# Altium schematic sheet PowerUpDelay-SCR.SchDoc
size 419 x 297 mm; SPICEModelCacheTYFAZRPR: <root> / <DocumentId>TYFAZRPR</DocumentId> / </root>; Date: 2025/07/16; Author: Leon Lee; CompanyName: 华南理工大学; Organization: 华南理工大学; Address1: 五山路381号; Address2: 天河区，广州市; Address3: 广东省; DocumentNumber: A001-001-001; Revision: 0.2; SheetNumber: 1; SheetTotal: 1
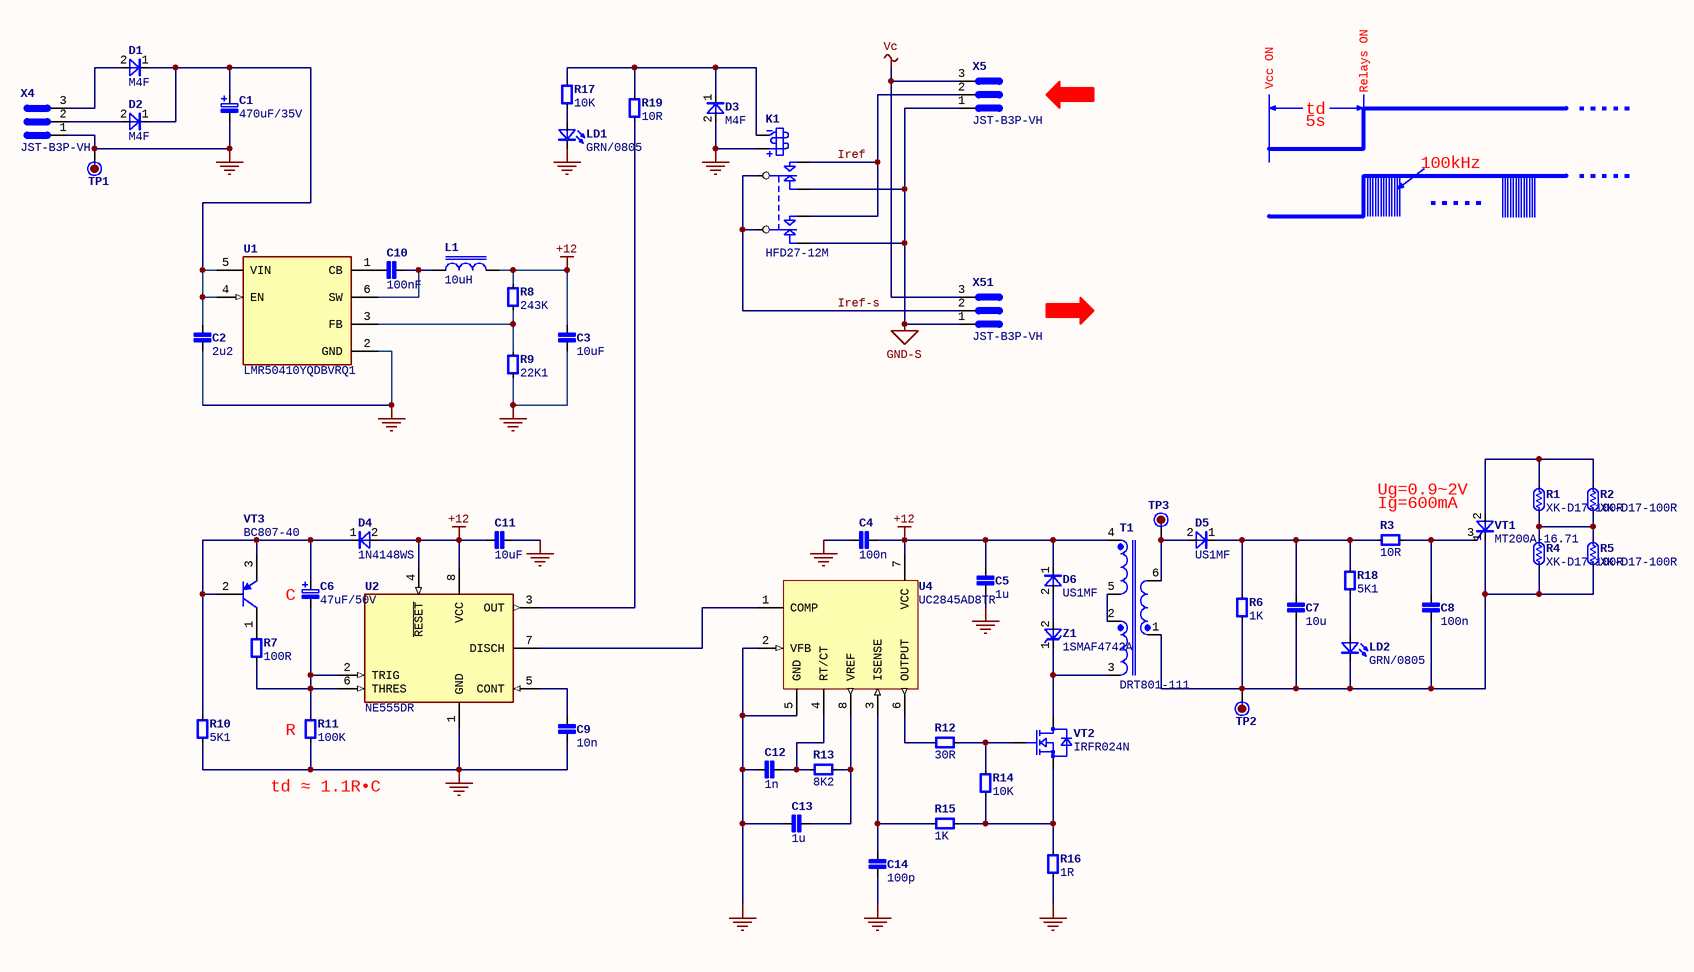
[diagram p0: PowerUpDelay-SCR.SchDoc]

## Parts
C1  470uF/35V  [RB5M/D10]
C2  2u2  [CAPC1206N]
C3  10uF  [CAPC0805N]
C4  100n  [CAPC0805N]
C5  1u  [CAPC0805N]
C6  47uF/50V  [RB2.5M/D6.3]
C7  10u  [CAPC1206N]
C8  100n  [CAPC1206N]
C9  10n  [CAPC0805N]
C10  100nF  [CAPC0805N]
C11  10uF  [CAPC0805N]
C12  1n  [CAPC0805N]
C13  1u  [CAPC0805N]
C14  100p  [CAPC0805N]
D1  M4F  [SMAF]
D2  M4F  [SMAF]
D3  M4F  [SMAF]
D4  1N4148WS  [SOD-323F-1K2A]
D5  US1MF  [SMAF]
D6  US1MF  [SMAF]
K1  HFD27-12M  [RLY-DPDT]
L1  10uH  [INDP4040X20N]
LD1  GRN/0805  [LEDC0805N]
LD2  GRN/0805  [LEDC0805N]
R1  XK-D17-100R  [PTC-X17]
R2  XK-D17-100R  [PTC-X17]
R3  10R  [RESC1206N]
R4  XK-D17-100R  [PTC-X17]
R5  XK-D17-100R  [PTC-X17]
R6  1K  [RESC1206N]
R7  100R  [RESC0805N]
R8  243K  [RESC0805N]
R9  22K1  [RESC0805N]
R10  5K1  [RESC0805N]
R11  100K  [RESC0805N]
R12  30R  [RESC0805N]
R13  8K2  [RESC0805N]
R14  10K  [RESC0805N]
R15  1K  [RESC0805N]
R16  1R  [RESC1206N]
R17  10K  [RESC0805N]
R18  5K1  [RESC0805N]
R19  10R  [RESC0805N]
T1  DRT801-111  [TRANS-DRT801-1+1+1]
TP1  TESTPOINT  [TESTPOINT]  (value not drawn)  (no BOM)
TP2  TESTPOINT  [TESTPOINT]  (value not drawn)  (no BOM)
TP3  TESTPOINT  [TESTPOINT]  (value not drawn)  (no BOM)
U1  LMR50410YQDBVRQ1  [FP-DBV0006A-MFG]
U2  NE555DR  [FP-D0008A-MFG]
U4  UC2845AD8TR  [D0008A_N]
VT1  MT200A-16.71  [MT200A-16.71]
VT2  IRFR024N  [ONSC-DPAK-3-369AA-01_V]
VT3  BC807-40  [SOT-23_N]
X4  JST-B3P-VH  [B3P-VH]
X5  JST-B3P-VH  [B3P-VH]
X51  JST-B3P-VH  [B3P-VH]
Z1  1SMAF4742A  [SMAF]

## Nets
+12: C3.1 C4.2 C5.1 C11.1 D4.2(A) D6.1(K) L1.2 R8.2 T1.4 U2.4(~{RESET}) U2.8(VCC) U4.7(VCC)
GND: C1.2 C2.2 C3.2 C4.1 C5.2 C9.2 C11.2 C12.1 C13.2 C14.2 D3.2(A) K1.COL1(COIL1) LD1.2(K) R9.1 R10.1 R11.2 R16.2 TP1.1 U1.2(GND) U2.1(GND) U4.2(VFB) U4.5(GND) X4.1
GND-S: K1.NC1 K1.NC2 X5.1 X51.1
Vc: X5.3 X51.3
Iref: K1.NO1 K1.NO2 X5.2
Iref-s: K1.COM1(COMMON1) K1.COM2(COMMON2) X51.2
NetC1_1: C1.1 C2.1 D1.1(K) D2.1(K) U1.4(EN) U1.5(VIN)
NetC6_1: C6.1 D4.1(K) R10.2 VT3.2(B) VT3.3(E)
NetC6_2: C6.2 R7.2 R11.1 U2.2(TRIG) U2.6(THRES)
NetC7_1: C7.1 D5.1(K) R3.1 R6.1 R18.1
NetC7_2: C7.2 C8.2 LD2.2(K) R4.1 R5.1 R6.2 T1.1 TP2.1 VT1.1(K)
NetC8_1: C8.1 R3.2 VT1.3(G)
NetC9_1: C9.1 U2.5(CONT)
NetC10_1: C10.1 U1.1(CB)
NetC10_2: C10.2 L1.1 U1.6(SW)
NetC12_2: C12.2 R13.2 U4.4(RT/CT)
NetC13_1: C13.1 R13.1 U4.8(VREF)
NetC14_1: C14.1 R15.1 U4.3(ISENSE)
NetD1_2: D1.2(A) X4.3
NetD2_2: D2.2(A) X4.2
NetD3_1: D3.1(K) K1.COL2(COIL2) R17.1 R19.1
NetD5_2: D5.2(A) T1.6 TP3.1
NetD6_2: D6.2(A) Z1.2(A)
NetLD1_1: LD1.1(A) R17.2
NetLD2_1: LD2.1(A) R18.2
NetR1_1: R1.1 R2.1 R4.2 R5.2
NetR1_2: R1.2 R2.2 VT1.2(A)
NetR7_1: R7.1 VT3.1(C)
NetR8_1: R8.1 R9.2 U1.3(FB)
NetR12_1: R12.1 R14.1 VT2.1(G)
NetR12_2: R12.2 U4.6(OUTPUT)
NetR14_2: R14.2 R15.2 R16.1 VT2.3(S)
NetR19_2: R19.2 U2.3(OUT)
NetT1_2: T1.2 T1.5
NetT1_3: T1.3 VT2.4(D) Z1.1(K)
NetU2_7: U2.7(DISCH) U4.1(COMP)

## Notes on the sheet
- Vcc ON
- Relays ON
- td
- 5s
- 100kHz
- Ug=0.9~2V
- Ig=600mA
- (near C6) C
- (near R11) R
- (near R11) td ≈ 1.1R•C
- DWG NO:
- 版  本
- REV:
- 摘          要
- 日  期
- 审  核
- 版 本
- 项目:
- 设 计
- 审 核
- 图 幅
- A3
- 第
- 页
- 共
- 版本控制
- 项目版本:
- 文件版本:

## Library data of the parts
C1 = CAPACITOR POL(S): 名称: 电解电容; 代号: C; 备注: Ø10x13mm，脚距5mm
C2 = CAPACITOR(S): 名称: 贴片陶瓷电容; 代号: C; 型号: X7R-50V-1206-10%; 备注: X7R/X5R系列
C3 C11 = CAPACITOR(S): 名称: 贴片陶瓷电容; 代号: C; 型号: X7R-25V-0805-10%; 备注: X7R/X5R系列
C4 C5 C9 C12-C14 = CAPACITOR(S): 备注: X5R或X7R系列; 代号: C; 名称: 贴片陶瓷电容; 型号: X7R-50V-0805-10%
C6 = CAPACITOR POL(S): 名称: 电解电容; 代号: C; 备注: Ø6.3x12mm，脚距2.5mm
C7 C8 = CAPACITOR(S): 备注: X5R或X7R系列; 代号: C; 名称: 贴片陶瓷电容; 型号: X7R-50V-1206-10%
C10 = CAPACITOR(S): 名称: 贴片陶瓷电容; 代号: C; 型号: X7R-50V-0805-10%; 备注: X7R/X5R系列
D1-D3 D5 D6 = DIODE(S): 二极管; 代号: D; 名称: 贴片二极管; 备注: SMAF封装
  D1-D3: 型号: M4F
  D5 D6: 型号: US1MF
D4 = DIODE(S): 二极管; 代号: D; 名称: 贴片二极管; 备注: SOD-323封装; 型号: 1N4148WS
K1 = RELAY-DPDT: 继电器; 代号: K; 名称: 信号继电器; 备注: 宏发, 线圈电压12V; 型号: HFD27-12M
L1 = IND: 代号: L; 名称: 贴片功率电感; 型号: XRRH3D28-100M; 备注: SMD, 4x4x3mm
LD1 LD2 = LED(S): 备注: 高亮; 代号: DS; 名称: 贴片LED; 型号: 0805-绿色
R1 R2 R4 R5 = RESISTOR(S) NL: None Liner Resistor; 代号: RP; 名称: PTC电阻; 型号: XK-MZ12-D17-100R; 备注: Ø17-100Ω，电焊机专用
R3 R6 R16 = RESISTOR(S): 名称: 贴片电阻; 代号: R; 型号: CR1206-1%; 备注: 风华或国巨
R7 R10 = RESISTOR(S): 电阻; 代号: R; 名称: 贴片电阻; 型号: CR0805-1%; 备注: 风华或国巨
R8 R9 = RESISTOR(S): 电阻; 代号: R; 名称: 贴片电阻; 型号: CR0805-1%
R11-R15 R17-R19 = RESISTOR(S): 名称: 贴片电阻; 代号: R; 型号: CR0805-1%; 备注: 风华或国巨
T1 = TRANSFORM-DRT801-111_FB: IGBT驱动变压器, DRT801/111, 12.5x16.6mm; 代号: T; 名称: 驱动变压器; 备注: 耀华德昌; 型号: DRT801-111
TP1-TP3 = TESTPOINT: 测试点; 代号: TP; 名称: 测试点
U1 = CMP-04918-000478-1: NIXON PLUS-LMR50410YQDBVRQ1; 代号: U; 名称: 贴片集成电路; 备注: TI; 型号: LMR50410YQDBVRQ1
U2 = CMP-1685-00007-2: IC OSC SGL TIMER 100KHZ 8-SOIC; Low Level Output Current: 200mA; Quiescent Current: 15mA; Min Supply Voltage: 4.5V; Number of Timers/Counters: 1; Max Supply Voltage: 16V; Operating Supply Current: 10mA; High Level Output Current: -200mA; 代号: U; 名称: 贴片集成电路; Packaging: Tape and Reel; Frequency: 100kHz; Weight: 0.002561oz; REACH SVHC: No SVHC; Package Quantity: 2500; Width: 3.91mm; Max Operating Temperature: 70°C; Contact Plating: Gold; Lead Free: Lead Free; Number of Pins: 8; Min Operating Temperature: 0°C; Radiation Hardening: No; Length: 4.9mm; Case/Package: SOIC; Height: 1.58mm; Mount: Surface Mount; 型号: NE555DR
U4 = CMP-0319-00631-2: PWM Controller with Current Control, 50 % Duty Cycle, -40 to +85 degC, 8-pin SOIC (D), Green (RoHS & no Sb/Br); Manufacturer: Texas Instruments; Duty Cycle(Max)(%): 50; Frequency(Max)(kHz): 450; Topology: Boost, Flyback, Forward; UVLO Thresholds On/Off(V): 8.4/7.6; Rating: Catalog; Regulated Outputs(#): 1; 代号: U; 名称: 贴片集成电路; Mounting Technology: Surface Mount; ComponentLink1URL: http://www.ti.com/general/docs/lit/getliterature.tsp?genericPartNumber=UC2845A&fileType=pdf; Eco-Plan: Green (RoHS & no Sb/Br); PackageReference: D0008A; ComponentLink1Description: Datasheet; Code_JEDEC: MS-012AA; PackageVersion: revM, Jun-2011; SubFamily: PWM Controller; PackageDescription: 8-Pin Plastic Small Outline Integrated Circuit, 4.9 x 3.9 mm, Pitch 1.27 mm Pitch; Control Method: Current; PartNumber: UC2845AD8TR; DatasheetVersion: SLUS224C; 型号: UC2845AD8TR
VT1 = SCR(S): 晶闸管; pin to pad: 1>2 2>1; 代号: VT; 名称: 晶闸管模块; 型号: MT200A-16.71
VT2 = MOSFET - N-CH: MOSFET N-CH D-PAK/TO252; Manufacturer: Fairchild; Part Number: SUD40N08-16-E3; 代号: VT; 备注: 或IRF120N; 名称: 贴片场效应管; 型号: IRFR024N
VT3 = PNP: PNP Bipolar Transistor; pin to pad: 1>3 2>1 3>2; 代号: Tr; 名称: 贴片三极管; 备注: PNP, 500mA, 45V, SOT23; Published: 8-Jun-2000; LatestRevisionDate: 29-May-2009; LatestRevisionNote: IPC-7351 Footprint Added.; PackageVersion: Aug-1999; PackageReference: SOT-23B; Publisher: Altium Limited; PackageDescription: 3-Pin SOT-23 Package 0.95 mm Pitch, 2.4 mm Lead Span; 型号: BC807-40
X4 X5 X51 = 3PIN-PCB-Connector: 线路板接插件; 代号: X; 名称: 接插件; 型号: 3.96mm间距
Z1 = DIODE ZENER(S): 齐纳二极管; 名称: 贴片稳压二极管; 代号: Z; 备注: SMAF封装; 型号: 1SMAF4742A